# Altium schematic sheet esp32.SchDoc
size A4
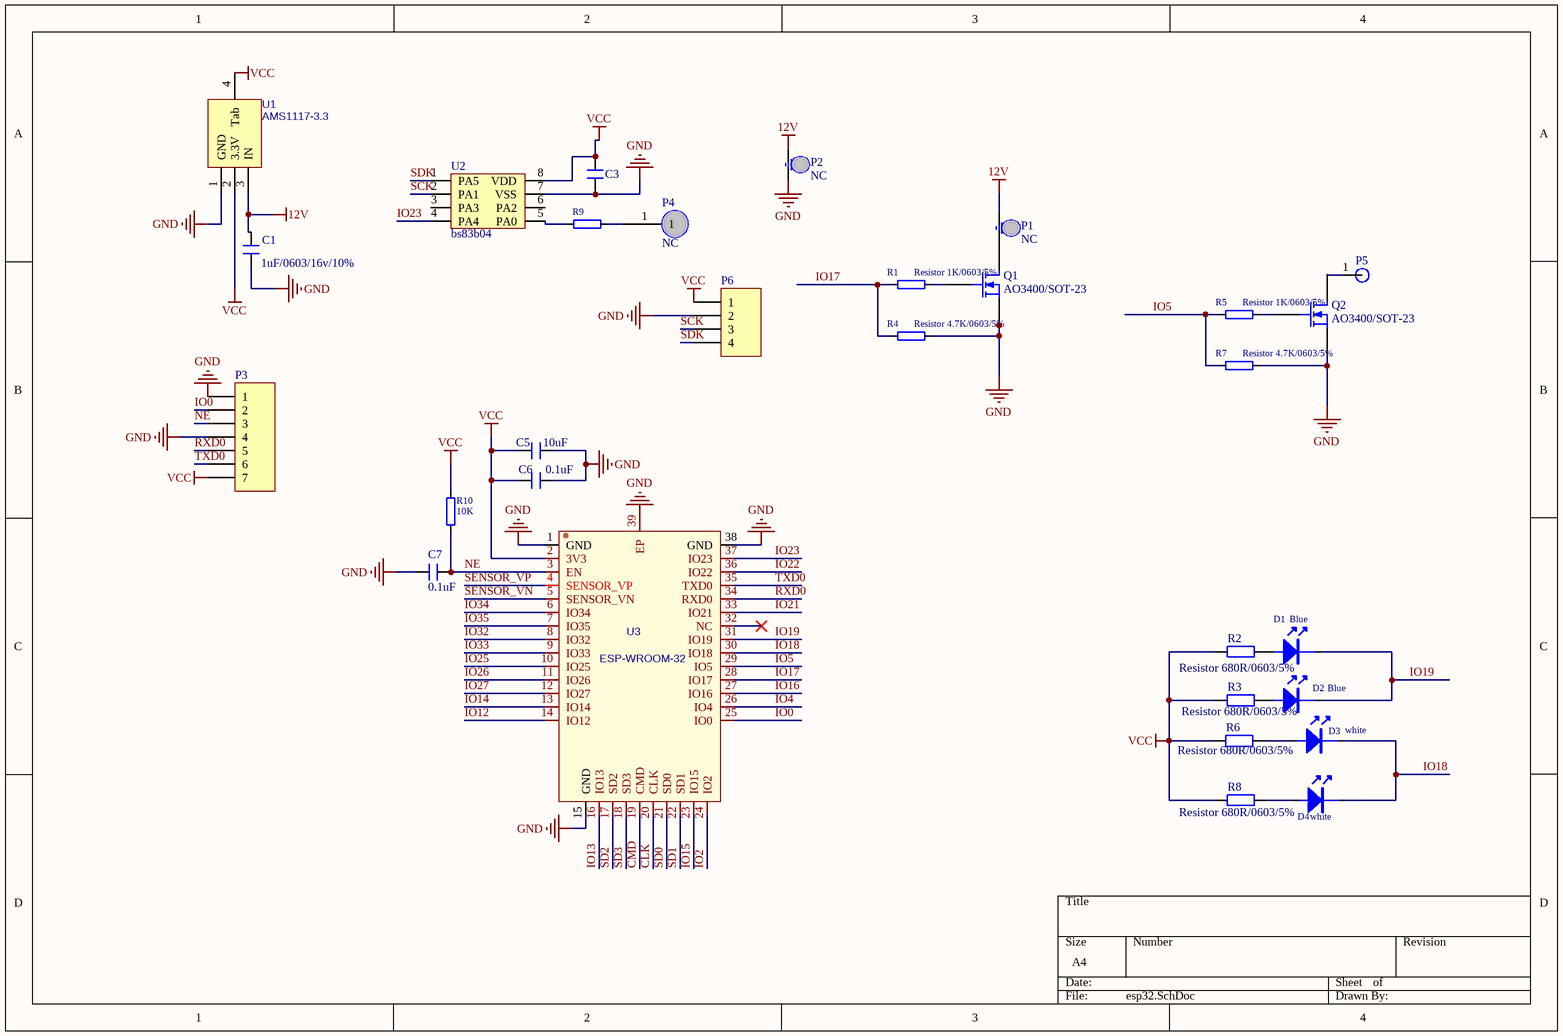
[diagram p0: esp32.SchDoc]

## Parts
C1  1uF/0603/16v/10%  [C0603]
C3  100nF  [C0603]  (value not drawn)
C5  10uF  [C0603]
C6  0.1uF  [C0603]
C7  0.1uF  [C0603]
D1  Blue  [1206反贴LED]
D2  Blue  [1206反贴LED]
D3  white  [1206反贴LED]
D4  white  [1206反贴LED]
P1  NC  [PAD_2]
P2  NC  [PAD_2]
P3  Header 7  [HDR1X7]  (value not drawn)
P4  NC  [TOUCH_PAD]
P5  PAD  [PAD]  (value not drawn)
P6  Header 4  [HDR1X4]  (value not drawn)
Q1  AO3400/SOT-23  [SOT_23_N-MOS]
Q2  AO3400/SOT-23  [SOT_23_N-MOS]
R1  Resistor 1K/0603/5%  [R0603]
R2  Resistor 680R/0603/5%  [R0603]
R3  Resistor 680R/0603/5%  [R0603]
R4  Resistor 4.7K/0603/5%  [R0603]
R5  Resistor 1K/0603/5%  [R0603]
R6  Resistor 680R/0603/5%  [R0603]
R7  Resistor 4.7K/0603/5%  [R0603]
R8  Resistor 680R/0603/5%  [R0603]
R9  Resistor 1K/0603/5%  [R0603]  (value not drawn)
R10  10K  [R0603]
U1  AMS1117-3.3  [SOT-223_L6.5-W3.5-P2.30-LS7.0-BR]
U2  bs83b04  [SOP8 - duplicate - duplicate]
U3  ESP-WROOM-32  [ESP-WROOM-32]

## Nets
12V: C1.2 P1.1 P2.1 U1.3(IN)
GND: C1.1 C3.1 C5.1 C6.2 C7.1 P2.2 P3.1 P3.4 P6.2 Q1.3(S) Q2.3(S) R4.1 R7.1 U1.1(GND) U2.7(VSS) U3.1(GND) U3.15(GND) U3.38(GND) U3.39(EP)
VCC: C3.2 C5.2 C6.1 P3.7 P6.1 R2.1 R3.1 R6.1 R8.1 R10.2 U1.2(3.3V) U1.4(Tab) U2.8(VDD) U3.2(3V3)
CLK: U3.20(CLK)
CMD: U3.19(CMD)
IO0: P3.2 U3.25(IO0)
IO2: U3.24(IO2)
IO4: U3.26(IO4)
IO5: R5.2 R7.2 U3.29(IO5)
IO12: U3.14(IO12)
IO13: U3.16(IO13)
IO14: U3.13(IO14)
IO15: U3.23(IO15)
IO16: U3.27(IO16)
IO17: R1.2 R4.2 U3.28(IO17)
IO18: D3.K D4.K U3.30(IO18)
IO19: D1.K D2.K U3.31(IO19)
IO21: U3.33(IO21)
IO22: U3.36(IO22)
IO23: U2.4(PA4) U3.37(IO23)
IO25: U3.10(IO25)
IO26: U3.11(IO26)
IO27: U3.12(IO27)
IO32: U3.8(IO32)
IO33: U3.9(IO33)
IO34: U3.6(IO34)
IO35: U3.7(IO35)
NE: C7.2 P3.3 R10.1 U3.3(EN)
RXD0: P3.5 U3.34(RXD0)
SCK: P6.3 U2.2(PA1)
SD0: U3.21(SD0)
SD1: U3.22(SD1)
SD2: U3.17(SD2)
SD3: U3.18(SD3)
SDK: P6.4 U2.1(PA5)
SENSOR_VN: U3.5(SENSOR_VN)
SENSOR_VP: U3.4(SENSOR_VP)
TXD0: P3.6 U3.35(TXD0)
NetD1_A: D1.A R2.2
NetD2_A: D2.A R3.2
NetD3_A: D3.A R6.2
NetD4_A: D4.A R8.2
NetP1_2: P1.2 Q1.1(D)
NetP4_1: P4.1 R9.1
NetP5_1: P5.1 Q2.1(D)
NetQ1_2: Q1.2(G) R1.1
NetQ2_2: Q2.2(G) R5.1
NetR9_2: R9.2 U2.5(PA0)

Not connected (* = marked no-connect by the designer): U2 3(PA3) 6(PA2); U3 32(NC)*

## Library data of the parts
C1 C5-C7 = C0603
C3 = C0603: 100nF/0603/16v/10%
D1-D4 = LED
P1 P2 = Light
P3 = Header 7: Header, 7-Pin; LatestRevisionDate: 17-Jul-2002; LatestRevisionNote: Re-released for DXP Platform.; Publisher: Altium Limited
P4 = TOUCH_PAD
P6 = Header 4: Header, 4-Pin; LatestRevisionDate: 17-Jul-2002; LatestRevisionNote: Re-released for DXP Platform.; Publisher: Altium Limited
Q1 Q2 = MOSFET-N: Published: 8-Jun-2000; LatestRevisionDate: 17-Jul-2002; LatestRevisionNote: Re-released for DXP Platform.; PackageVersion: 1995/1996; PackageReference: E3; Publisher: Altium Limited; PackageDescription: TO, Flat Index; 3 In-Line, Axial Leads; Body Dia. 4.6mm; Lead Dia. 0.5 mm (max)
R1 R4 R5 R7 R9 R10 = RES
R2 R3 R6 R8 = Res2: Resistor 2.2K/0603/5%; Value: 1K; Published: 8-Jun-2000; LatestRevisionDate: 17-Jul-2002; LatestRevisionNote: Re-released for DXP Platform.; PackageReference: AXIAL-0.4; Publisher: Altium Limited; PackageDescription: Axial Device, Thru-Hole; 2 Leads; 0.4 in Pin Spacing
U1 = AMS1117-3.3: BOM_Manufacturer: SK; Contributor: LCSC; SMT Type: Extend; BOM_Supplier: LCSC; BOM_Supplier Part: C165482; BOM_Manufacturer Part: AMS1117-3.3; BOM_LCSC Assembly: Yes; spicePre: U; spiceSymbolName: AMS1117-3.3_C165482
U2 = ASC0130C
U3 = ESP-WROOM-32: BOM_Manufacturer: ESPRESSIF; BOM_Supplier: LCSC; BOM_Manufacturer Part: ESP-WROOM-32; BOM_Supplier Part: C95209; spicePre: U; spiceSymbolName: ESP-WROOM-32